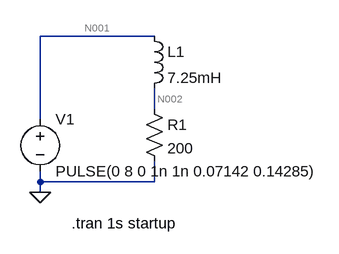
[diagram p0: schematic lcr.asc]
lcr.asc, the LTspice schematic file:
Version 4
SHEET 1 880 680
WIRE 256 0 80 0
WIRE 256 112 256 80
WIRE 80 128 80 0
WIRE 80 224 80 208
WIRE 256 224 256 192
WIRE 256 224 80 224
WIRE 80 240 80 224
FLAG 80 240 0
SYMBOL voltage 80 112 R0
WINDOW 123 0 0 Left 2
WINDOW 39 0 0 Left 2
SYMATTR InstName V1
SYMATTR Value PULSE(0 8 0 1n 1n 0.07142 0.14285)
SYMBOL res 240 96 R0
SYMATTR InstName R1
SYMATTR Value 200
SYMBOL ind 240 -16 R0
SYMATTR InstName L1
SYMATTR Value 7.25mH
TEXT 128 288 Left 2 !.tran 1s startup

The netlist it stands for:
* lcr.asc
V1 N001 0 PULSE(0 8 0 1n 1n 0.07142 0.14285)
R1 N002 0 200
L1 N001 N002 7.25mH
.tran 1s startup
.backanno
.end

* Results of the author's LTspice run, read from the files saved beside the schematic
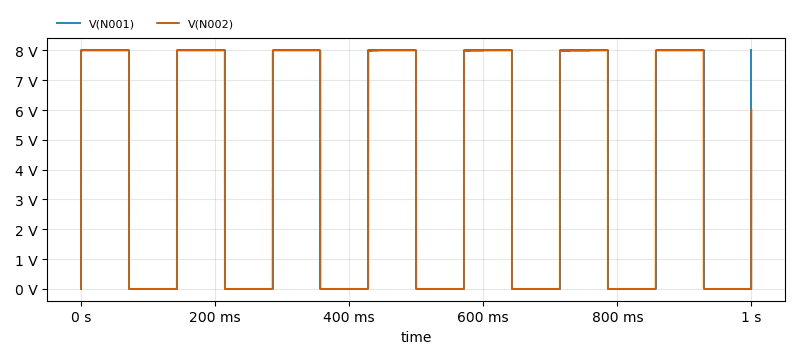
[diagram p1: Transient Analysis of lcr.asc, plotted from the saved traces]
* Transient Analysis, 1 run:
*   V(N001): min 0 V, max 8 V, average 4 V, rms 5.657 V, last 8 V
*   V(N002): min 0 V, max 8.004 V, average 3.998 V, rms 5.653 V, last 6.009 V